# EAGLE design ASD2111 (EAGLE 6.3)
DATABASE: ./../../../../../Components/TinyCircuits_Part_Database.txt
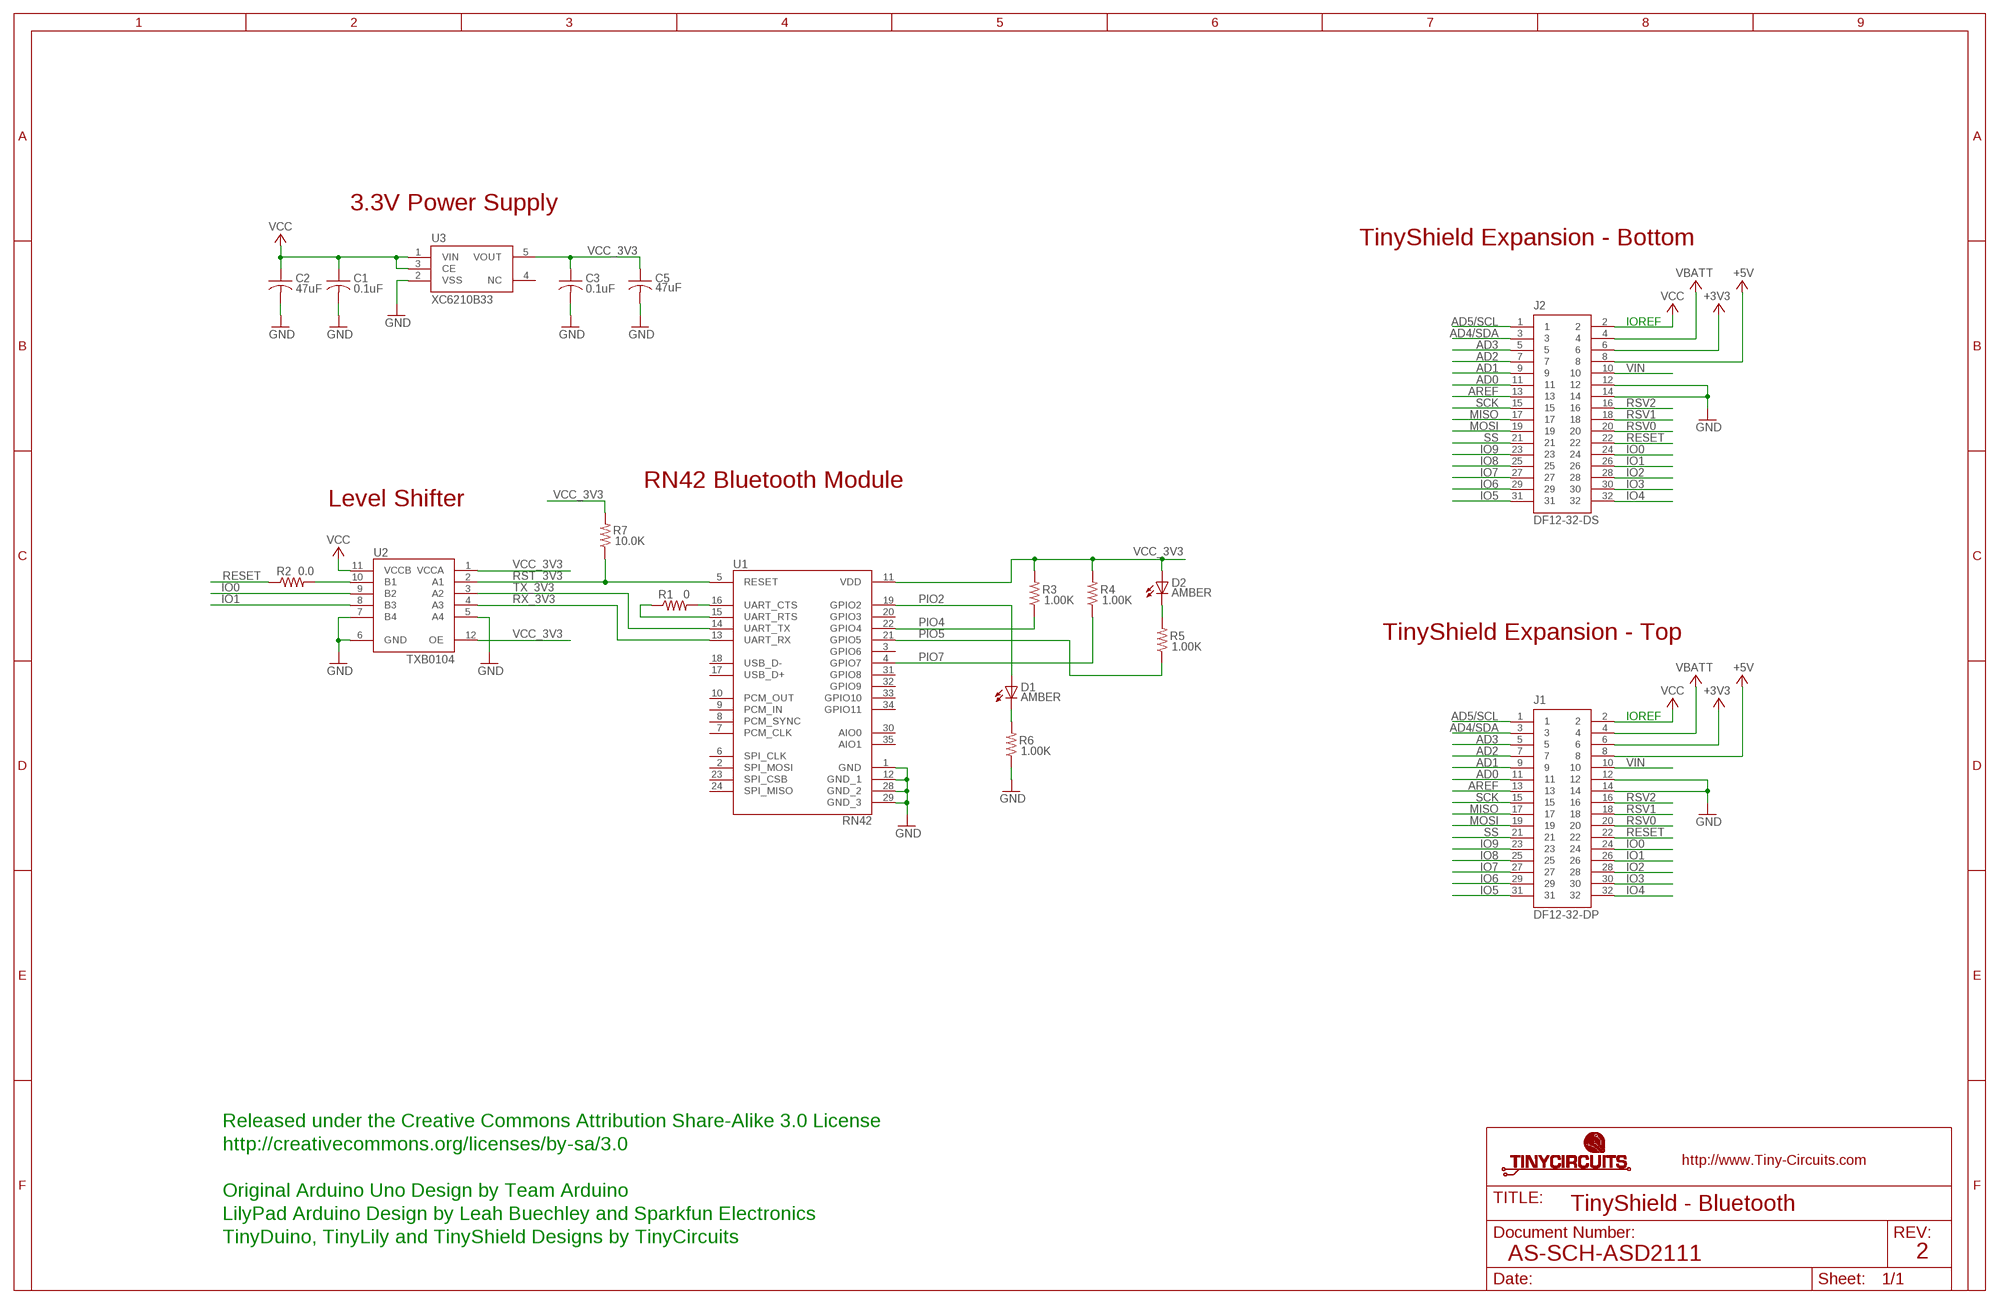
[diagram p0: schematic, sheet 1]

## Parts
C1  0.1uF  AS-ITM-00008  [C0402]
C2  47uF  AS-ITM-00049  [C1206]
C3  0.1uF  AS-ITM-00008  [C0402]
C5  47uF  AS-ITM-00049  [C1206]
D1  AMBER  AS-ITM-00026  [LNJ_LED]
D2  AMBER  AS-ITM-00026  [LNJ_LED]
J1  DF12-32-DP  AS-ITM-00015  [DF12-32-DP]
J2  DF12-32-DS  AS-ITM-00012  [DF12-32-DS]
R1  0  AS-ITM-000760402_SHORT  [0402_SHORT]
R2  0.0  AS-ITM-00076  [0402]
R3  1.00K  AS-ITM-00003  [0402]
R4  1.00K  AS-ITM-00003  [0402]
R5  1.00K  AS-ITM-00003  [0402]
R6  1.00K  AS-ITM-00003  [0402]
R7  10.0K  AS-ITM-00032  [0402]
U1  RN42  AS-ITM-00071  [RN42_BLUETOOTH_MODULE]
U2  TXB0104  AS-ITM-00048  [UQFN-12]
U3  XC6210B33  AS-ITM-00046  [SOT-25]

## Nets
+3V3: J1.6 J2.6
+5V: J1.8 J2.8
AD0: J1.11 J2.11
AD1: J1.9 J2.9
AD2: J1.7 J2.7
AD3: J1.5 J2.5
AD4/SDA: J1.3 J2.3
AD5/SCL: J1.1 J2.1
AREF: J1.13 J2.13
GND: C1.2 C2.2 C3.2 C5.2 J1.12 J1.14 J2.12 J2.14 R6.1 U1.1(GND) U1.12(GND_1) U1.28(GND_2) U1.29(GND_3) U2.5(A4) U2.6(GND) U2.7(B4) U3.2(VSS)
IO0: J1.24 J2.24 U2.9(B2)
IO1: J1.26 J2.26 U2.8(B3)
IO2: J1.28 J2.28
IO3: J1.30 J2.30
IO4: J1.32 J2.32
IO5: J1.31 J2.31
IO6: J1.29 J2.29
IO7: J1.27 J2.27
IO8: J1.25 J2.25
IO9: J1.23 J2.23
MISO: J1.17 J2.17
MOSI: J1.19 J2.19
N$4: R1.2 U1.16(UART_CTS)
N$5: R1.1 U1.15(UART_RTS)
N$6: R2.2 U2.10(B1)
N$8: D1.C R6.2
N$9: D2.C R5.2
PIO2: D1.A U1.19(GPIO2)
PIO4: R3.1 U1.22(GPIO4)
PIO5: R5.1 U1.21(GPIO5)
PIO7: R4.1 U1.4(GPIO7)
RESET: J1.22 J2.22 R2.1
RST_3V3: R7.1 U1.5(RESET) U2.2(A1)
RSV0: J1.20 J2.20
RSV1: J1.18 J2.18
RSV2: J1.16 J2.16
RX_3V3: U1.13(UART_RX) U2.4(A3)
SCK: J1.15 J2.15
SS: J1.21 J2.21
TX_3V3: U1.14(UART_TX) U2.3(A2)
VBATT: J1.4 J2.4
VCC: C1.1 C2.1 J1.2 J2.2 U2.11(VCCB) U3.1(VIN) U3.3(CE)
VCC_3V3: C3.1 C5.1 D2.A R3.2 R4.2 R7.2 U1.11(VDD) U2.1(VCCA) U2.12(OE) U3.5(VOUT)
VIN: J1.10 J2.10
Unconnected: U1.2(SPI_MOSI) U1.3(GPIO6) U1.6(SPI_CLK) U1.7(PCM_CLK) U1.8(PCM_SYNC) U1.9(PCM_IN) U1.10(PCM_OUT) U1.17(USB_D+) U1.18(USB_D-) U1.20(GPIO3) U1.23(SPI_CSB) U1.24(SPI_MISO) U1.30(AIO0) U1.31(GPIO8) U1.32(GPIO9) U1.33(GPIO10) U1.34(GPIO11) U1.35(AIO1) U3.4(NC)

## Notes on the sheet
- 3.3V Power Supply
- TinyShield Expansion - Bottom
- IOREF
- RN42 Bluetooth Module
- Level Shifter
- TinyShield Expansion - Top
- IOREF
- Released under the Creative Commons Attribution Share-Alike 3.0 License
- http://creativecommons.org/licenses/by-sa/3.0
- Original Arduino Uno Design by Team Arduino
- TinyShield - Bluetooth
- LilyPad Arduino Design by Leah Buechley and Sparkfun Electronics
- TinyDuino, TinyLily and TinyShield Designs by TinyCircuits
- AS-SCH-ASD2111 | 2

## Library data of the parts
C1 C3 = tinycircuits:AS-ITM-00008: CAP CER 0.1UF 16V 10% X5R 0402; PARTNO: AS-ITM-00008
C2 C5 = tinycircuits:AS-ITM-00049: CAP CER 47UF 6.3V 20% X6S 1206; PARTNUM: AS-ITM-00049
D1 D2 = tinycircuits:AS-ITM-00026: LED AMBER SIDE VIEW SMD; PARTNO: AS-ITM-00026
J1 = tinycircuits:AS-ITM-00015: CONN HEADER 32POS 3MM SMD 0.5MM; PARTNO: AS-ITM-00015
J2 = tinycircuits:AS-ITM-00012: CONN RECEPT 32POS 3MM SMD 0.5MM; PARTNO: AS-ITM-00012
R1 = tinycircuits:AS-ITM-00076: RES 0.0 OHM 1/16W 1% 0402 SMD
R2 = tinycircuits:AS-ITM-00076: RES 0.0 OHM 1/16W 1% 0402 SMD; PARTNO: AS-ITM-00076
R3-R6 = tinycircuits:AS-ITM-00003: RES 1.00K OHM 1/16W 1% 0402; PARTNO: AS-ITM-00003
R7 = tinycircuits:AS-ITM-00032: RES 10.0K OHM 1/16W 1% 0402 SMD; PARTNO: AS-ITM-00032
U1 = tinycircuits:AS-ITM-00071: RN42 BLUETOOTH MODULE; PARTNO: AS-ITM-00071
U2 = tinycircuits:AS-ITM-00048: IC VOLT-LEVEL TRANSLATOR 12UQFN; PARTNO: AS-ITM-00048
U3 = tinycircuits:AS-ITM-00046: IC REG LDO 3.3V .7A SOT-25; PARTNO: AS-ITM-00046

## Board
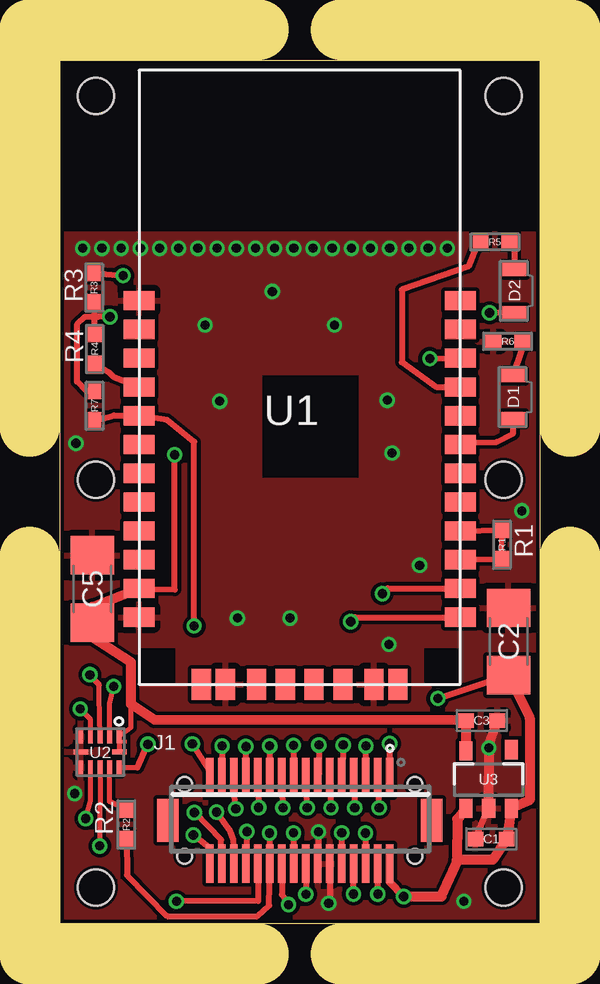
[diagram p1: board, top side]
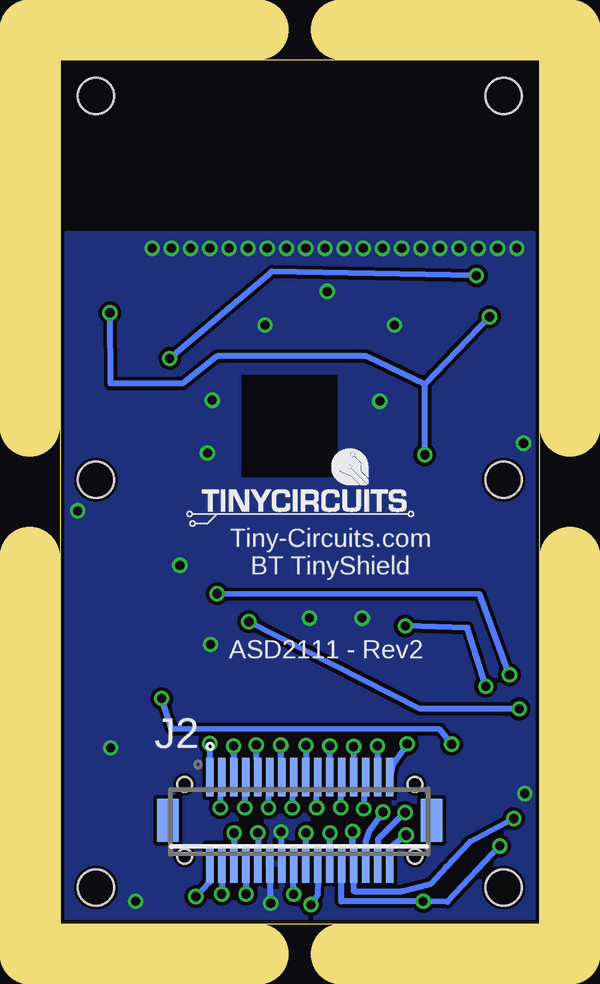
[diagram p2: board, bottom side, seen from below]

Size 20 x 36 mm. Coordinates in mm from the lower left corner, seen from the top.
Outline: 0,36 20,36 20,0 0,0 0,36
Copper layers (1*16): Top 0.035mm / dielectric 1.5mm / Bottom 0.035mm
Design rules "default *": minimum track width 8mil, minimum drill 15mil, track to track 6mil, track to pad 6mil, pad to pad 6mil, via to via 6mil, smd to smd 6mil, copper to edge 6mil, drill to drill 8mil, minimum pad ring 10mil, minimum via ring 5mil, stop-mask expansion 4mil, vias tented up to drill 25mil, thermal gap 10mil
Holes 1.5 mm at 1.5,18.5 18.5,18.5 18.5,1.5 1.5,1.5 1.5,34.5 18.5,34.5
tRestrict: area 8.4,18.6 to 12.4,22.8
bRestrict: area 8.4,18.6 to 12.4,22.9
Milling: 8 lines

### Footprints (pad centres in the part's own frame; a part is rotated, then mirrored left to right if it is on the bottom)
C0402 = smd 0.65 x 0.6: 1 -0.65,0; 2 0.65,0
C1206 = smd 1.6 x 1.8: 1 -1.4,0; 2 1.4,0
LNJ_LED = smd 1 x 0.55: A 0,0.9; C 0,-0.9
DF12-32-DP = smd 0.3 x 1.6: 1 -3.75,-1.8; 2 -3.75,1.8; 3 -3.25,-1.8; 4 -3.25,1.8; 5 -2.75,-1.8; 6 -2.75,1.8; 7 -2.25,-1.8; 8 -2.25,1.8; 9 -1.75,-1.8; 10 -1.75,1.8; 11 -1.25,-1.8; 12 -1.25,1.8; 13 -0.75,-1.8; 14 -0.75,1.8; 15 -0.25,-1.8; 16 -0.25,1.8; 17 0.25,-1.8; 18 0.25,1.8; 19 0.75,-1.8; 20 0.75,1.8; 21 1.25,-1.8; 22 1.25,1.8; 23 1.75,-1.8; 24 1.75,1.8; 25 2.25,-1.8; 26 2.25,1.8; 27 2.75,-1.8; 28 2.75,1.8; 29 3.25,-1.8; 30 3.25,1.8; 31 3.75,-1.8; 32 3.75,1.8 | smd 0.9 x 1.8: F1 -5.5,0; F2 5.5,0 | hole 0.6: -4.8,1.5; 4.8,1.5
DF12-32-DS = smd 0.3 x 1.6: 1 -3.75,1.8; 2 -3.75,-1.8; 3 -3.25,1.8; 4 -3.25,-1.8; 5 -2.75,1.8; 6 -2.75,-1.8; 7 -2.25,1.8; 8 -2.25,-1.8; 9 -1.75,1.8; 10 -1.75,-1.8; 11 -1.25,1.8; 12 -1.25,-1.8; 13 -0.75,1.8; 14 -0.75,-1.8; 15 -0.25,1.8; 16 -0.25,-1.8; 17 0.25,1.8; 18 0.25,-1.8; 19 0.75,1.8; 20 0.75,-1.8; 21 1.25,1.8; 22 1.25,-1.8; 23 1.75,1.8; 24 1.75,-1.8; 25 2.25,1.8; 26 2.25,-1.8; 27 2.75,1.8; 28 2.75,-1.8; 29 3.25,1.8; 30 3.25,-1.8; 31 3.75,1.8; 32 3.75,-1.8 | smd 0.9 x 1.8: F1 -5.5,0; F2 5.5,0 | hole 0.6: -4.8,1.5; 4.8,1.5
0402_SHORT = smd 0.65 x 0.55: 1 -0.6,0; 2 0.6,0
0402 = smd 0.65 x 0.55: 1 -0.6,0; 2 0.6,0
RN42_BLUETOOTH_MODULE = smd 1.3 x 0.8: 1 -6.35,4.57; 2 -6.35,3.37; 3 -6.35,2.17; 4 -6.35,0.97; 5 -6.35,-0.23; 6 -6.35,-1.43; 7 -6.35,-2.63; 8 -6.35,-3.83; 9 -6.35,-5.03; 10 -6.35,-6.23; 11 -6.35,-7.43; 12 -6.35,-8.63; 13 7.05,-8.63; 14 7.05,-7.43; 15 7.05,-6.23; 16 7.05,-5.03; 17 7.05,-3.83; 18 7.05,-2.63; 19 7.05,-1.43; 20 7.05,-0.23; 21 7.05,0.97; 22 7.05,2.17; 23 7.05,3.37; 24 7.05,4.57 | smd 0.8 x 1.3: 28 3.45,-11.43; 29 -2.75,-11.43; 30 4.45,-11.43; 31 2.15,-11.43; 32 0.95,-11.43; 33 -0.25,-11.43; 34 -1.45,-11.43; 35 -3.75,-11.43
UQFN-12 = smd 0.2 x 0.6: 1 -0.8,-0.65; 2 -0.4,-0.65; 3 0,-0.65; 4 0.4,-0.65; 5 0.8,-0.65; 7 0.8,0.65; 8 0.4,0.65; 9 0,0.65; 10 -0.4,0.65; 11 -0.8,0.65 | smd 0.6 x 0.2: 6 0.8,0; 12 -0.8,0
SOT-25 = smd 0.55 x 0.8: 1 -0.95,-1.2; 2 0,-1.2; 3 0.95,-1.2; 4 0.95,1.25; 5 -0.95,1.2

### Placement (x,y rotation side)
C1  17.98,3.53 180 top
C2  18.71,11.76 90 top
C3  17.59,8.46 0 top
C5  1.35,13.95 90 top
D1  18.9,21.94 180 top
D2  18.95,26.37 180 top
J1  10,4.3 180 top
J2  10,4.3 0 bottom
R1  18.44,15.8 90 top
R2  2.77,4.13 90 top
R3  1.43,26.51 270 top
R4  1.46,23.96 90 top
R5  18.14,28.41 0 top
R6  18.67,24.27 0 top
R7  1.45,21.59 90 top
U1  9.65,21.4 0 top
U2  1.67,7.16 180 top
U3  17.87,6 0 top
U$1  [DOCFIELD-TINYCIRCUITS-PCB]  33.91,-10 0 top  (outside the outline)

### Tracks (layer width: path | path; a pad name or v marks a point on that pad's centre or on a via)
+3V3  (via drill 0.38)
  Top 0.254: J2.6 v12.75,3.77 v12.74,3.77
  Bottom 0.254: v12.74,3.77 12.74,2.51 J2.6
+5V  (via drill 0.38)
  Top 0.254: v12.24,1.23 J2.8
  Bottom 0.254: J2.8 12.25,1.21 v12.24,1.23
AD0  (via drill 0.38)
  Top 0.254: v11.3,4.83 11.31,5.05 J2.11
  Bottom 0.254: J2.11 11.28,5.79 v11.3,4.83
AD1  (via drill 0.38)
  Top 0.254: J2.9 11.79,6.27 v11.81,7.44
  Bottom 0.254: v11.81,7.44 11.78,6.22 J2.9
AD2  (via drill 0.38)
  Top 0.254: v12.29,4.83 12.31,5.05 J2.7
  Bottom 0.254: J2.7 12.27,5.86 v12.29,4.83
AD3  (via drill 0.38)
  Top 0.254: J2.5 v12.76,7.4
  Bottom 0.254: v12.76,7.4 J2.5
AD4/SDA  (via drill 0.38)
  Top 0.254: v13.31,4.83 13.31,5 J2.3
  Bottom 0.254: J2.3 13.28,5.86 v13.31,4.83
AD5/SCL  (via drill 0.38)
  Top 0.254: v13.75,7.5 J2.1
  Bottom 0.254: J2.1 v13.75,7.5
AREF  (via drill 0.38)
  Top 0.254: J2.13 10.8,6.27 v10.8,7.44
  Bottom 0.254: v10.8,7.44 10.77,6.59 J2.13
GND  (via drill 0.38)
  Top 0.254: v11.21,0.85 11.21,1 11.25,1.04 J2.12 11.25,0.86 v11.21,0.85 | v11.21,0.85 11.21,0.79 11.23,0.77 | C1.2 U3.2 | v10.78,3.82 J2.14
  Top 0.406: C3.2 17.89,7.5 U3.2
  Bottom 0.254: 11.25,1.79 11.25,0.86 v11.21,0.85 | J2.14 v10.78,3.82
  other vias: 17.89,7.32 6.05,24.95 6.66,21.78 13.85,19.62 19.26,17.2 16.85,0.92 7.4,12.73 0.67,20.02 13.72,11.64 0.62,5.42 2.55,28.15 3.35,28.15 4.15,28.15 4.95,28.15 5.75,28.15 6.55,28.15 7.35,28.15 8.15,28.15 8.95,28.15 9.75,28.15 10.55,28.15 11.35,28.15 12.15,28.15 12.95,28.15 13.75,28.15 14.55,28.15 15.35,28.15 16.15,28.15 1.75,28.15 0.95,28.15 8.85,26.35 11.45,24.95 13.65,21.82 9.6,12.73 15,14.93
  pour Top: 0.25,28.75 19.75,28.75 19.75,0.25 0.25,0.25
  pour Bottom: 0.25,28.75 19.75,28.75 19.75,0.25 0.25,0.25
IO0  (via drill 0.38)
  Top 0.203: U2.9 v1.66,3.23
  Top 0.254: J2.24 8.26,2.5 8.26,0.95 v4.86,0.92
  Bottom 0.254: J2.24 8.26,0.92 v4.86,0.92 3.84,0.9 v1.66,3.23
IO1  (via drill 0.38)
  Top 0.203: v1.07,4.38 1.28,5.11 U2.8
  Top 0.254: v7.8,3.84 J2.26
  Bottom 0.254: J2.26 v7.8,3.84 7.83,3.59 7.75,1.35 5.75,1.35 4.53,1.66 3.89,2.37 2.9,3.41 v1.07,4.38
IO2  (via drill 0.38)
  Top 0.254: v6.53,4.64 7.07,3.89 7.22,3.49 7.29,2.61 7.26,2.51 J2.28
  Bottom 0.254: J2.28 7.24,3.43 7.07,3.88 v6.53,4.64
IO3  (via drill 0.38)
  Top 0.254: J2.30 6.73,3.49 v5.61,4.63
  Bottom 0.254: v5.61,4.63 6.75,3.51 6.77,2.53 J2.30
IO4  (via drill 0.38)
  Top 0.254: J2.32 6.25,3.14 v5.56,3.69
  Bottom 0.254: v5.56,3.69 5.61,3.65 6.21,3.18 6.21,3.14 6.26,3.1 J2.32
IO5  (via drill 0.38)
  Top 0.254: v5.52,7.49 6.23,6.38 J2.31
  Bottom 0.254: J2.31 6.11,6.64 v5.52,7.49
IO6  (via drill 0.38)
  Top 0.254: J2.29 6.76,6.11 v6.76,7.4
  Bottom 0.254: J2.29 6.75,7.39 v6.76,7.4
IO7  (via drill 0.38)
  Top 0.254: v7.33,4.78 7.31,4.9 J2.27
  Bottom 0.254: J2.27 7.29,5.76 v7.33,4.78
IO8  (via drill 0.38)
  Top 0.254: J2.25 v7.75,7.37
  Bottom 0.254: v7.75,7.37 J2.25
IO9  (via drill 0.38)
  Top 0.254: v8.29,4.83 8.31,4.98 J2.23
  Bottom 0.254: J2.23 8.28,5.59 v8.29,4.83
MISO  (via drill 0.38)
  Top 0.254: J2.17 v9.75,7.41 v9.74,7.42
  Bottom 0.254: v9.74,7.42 9.74,6.11 J2.17
MOSI  (via drill 0.38)
  Top 0.254: v9.3,4.83 9.31,4.95 J2.19
  Bottom 0.254: J2.19 9.27,5.76 v9.3,4.83
N$4
  Top 0.254: U1.16 R1.2
N$5
  Top 0.254: U1.15 R1.1
N$6
  Top 0.203: R2.2 2.14,5.06 2.07,5.09 U2.10
N$8
  Top 0.254: D1.C 19.27,23.96 R6.2
N$9
  Top 0.254: R5.2 18.95,28.2 D2.C
PIO2
  Top 0.254: U1.19 16.78,20 16.92,20 16.82,20.05 18.22,20.07 18.9,20.43 D1.A
PIO4  (via drill 0.38)
  Top 0.254: R3.1 v2.63,27.01 | v15.43,23.55 U1.22
  Bottom 0.254: v2.63,27.01 11.16,27.19 v15.43,23.55
PIO5
  Top 0.254: R5.1 17.43,28.38 17.02,27.39 14.26,26.43 14.26,23.4 15.69,22.37 U1.21
PIO7
  Top 0.254: R4.1 2.04,22.98 2.22,22.81 U1.4
RESET  (via drill 0.38)
  Top 0.254: v8.74,3.77 J2.22 8.77,2.48 8.72,0.74 8.24,0.31 4.48,0.31 2.8,2.02 R2.1
  Bottom 0.254: J2.22 8.75,3.69 v8.74,3.77
RST_3V3  (via drill 0.38)
  Top 0.203: U2.2 2.06,9.15 2.24,9.86 v2.24,9.89
  Top 0.254: v5.6,12.4 5.6,20.07 4.48,20.99 U1.5 3.29,21.18 2.25,21.18 1.8,21.06 R7.1
  Bottom 0.254: v2.24,9.89 3.01,12.33 v5.6,12.4
RSV0  (via drill 0.38)
  Top 0.254: J2.20 9.25,1.2 v9.54,0.79
  Bottom 0.254: J2.20 9.25,1.84 9.25,1.2 v9.54,0.79
RSV1  (via drill 0.38)
  Top 0.254: v9.74,3.77 9.74,2.51 J2.18
  Bottom 0.254: J2.18 9.75,3.72 v9.74,3.77
RSV2  (via drill 0.38)
  Top 0.254: J2.16 10.25,1.16 v10.25,1.22
  Bottom 0.254: v10.25,1.22 J2.16
RX_3V3  (via drill 0.38)
  Top 0.203: U2.4 1.28,8.51 v0.85,8.95
  Top 0.254: v12.12,12.58 12.31,12.77 U1.13
  Bottom 0.254: v0.85,8.95 4.99,8.95 v12.12,12.58
SCK  (via drill 0.38)
  Top 0.254: v10.31,4.83 10.31,4.98 J2.15
  Bottom 0.254: J2.15 10.29,5.66 v10.31,4.83
SS  (via drill 0.38)
  Top 0.254: v8.75,7.4 J2.21
  Bottom 0.254: J2.21 v8.75,7.39 v8.75,7.4
TX_3V3  (via drill 0.38)
  Top 0.203: U2.3 1.63,9.5 1.63,9.94
  Top 0.254: 1.63,9.94 1.25,10.34 v1.25,10.37 | v13.44,13.75 13.66,13.97 U1.14
  Bottom 0.254: v1.25,10.37 2.5,13.72 v13.44,13.75
VBATT  (via drill 0.38)
  Top 0.254: v13.25,1.23 J2.4
  Bottom 0.254: J2.4 13.25,1.24 v13.25,1.23
VCC  (via drill 0.38)
  Top 0.203: U2.11 3.23,6.51
  Top 0.254: 16.54,2.65 16.61,2.68 | J2.2 13.75,1.73 | 3.23,6.51 v3.66,7.48 | v15.76,9.38 C2.1
  Top 0.305: 13.75,1.73 v14.33,1.12
  Top 0.406: C2.1 19.59,8.57 19.59,5.14 U3.3 C1.1 18.07,2.68 16.61,2.68 15.91,1.12 v14.33,1.12 | U3.1 16.57,4.35 16.54,2.65
  Bottom 0.254: v14.33,1.12 13.77,1.71 J2.2 | v3.66,7.48 4.15,8.09 15.35,8.11 v15.76,9.38
VCC_3V3  (via drill 0.38)
  Top 0.203: 2.95,9.15 2.95,8.16 U2.1 U2.12
  Top 0.254: C5.1 1.35,13.21 3.39,13.95 4.78,13.93 v4.78,19.54 | R4.2 1.45,25.3 | 1.45,25.3 R3.2 | v2.08,25.29 1.45,25.3 | v17.91,25.46 18.04,25.48 D2.A | R7.2 1.1,22.2 0.71,22.59 0.72,24.99 1.05,25.3 1.6,25.3 1.45,25.3
  Top 0.406: 1.35,13.21 U1.11 | C5.1 1.3,11.97 2.95,10.9 2.95,9.15 3.95,8.49 C3.1 U3.5
  Bottom 0.254: v4.78,19.54 4.78,22.49 | 4.78,22.49 v2.08,25.29 | 4.78,22.49 7.22,23.66 13.44,23.66 14.89,22.51 17.89,22.51 v17.91,25.46
VIN  (via drill 0.38)
  Top 0.254: J2.10 v11.76,3.78 v11.75,3.78
  Bottom 0.254: v11.75,3.78 J2.10

### Text on the board
tPlace: R3 | R4 | R1 | R2
bPlace: Tiny-Circuits.com | BT TinyShield | ASD2111 - Rev2
Document: FABRICATION DRAWING | NOTES: | 1. PRINTED CIRCUIT BOARD MADE FROM NEMA GRADE FR-4 EPOXY LAMINATE | WITH 1 OUNCE COPPER PLATING AND .024 THICKNESS. | 2. ALL DIMENSIONS ARE GIVEN IN INCHES. | 3. CIRCUIT PATHS ARE FOR REFERENCE ONLY. | 4. HOLE SIZES SHOWN ARE FINISHED DIAMETERS AFTER PLATING. | 5. BOARD PLATED USING REFLOW OR SIMILAR METHOD. | 6. BOARD TO HAVE BLUE SOLDER MASK ON PLATED SURFACES USING WET FILM | 7. SILKSCREEN BOARD USING WHITE INK. | SR100 OR SR1010 EPOXY. EQUIVALENT WET OR DRY FILM MAY BE USED. | 8. THE FOLLOWING INFORMATION APPLIES TO THIS BOARD: | * 2 COPPER LAYERS | * .024 BOARD THICKNESS | * REQUIRES TOP SIDE SILKSCREEN | Released under the Creative Commons Attribution Share-Alike 3.0 License | http://creativecommons.org/licenses/by-sa/3.0 | Original Arduino Uno Design by Team Arduino | LilyPad Arduino Design by Leah Buechley and Sparkfun Electronics | TinyDuino, TinyLily and TinyShield Designs by TinyCircuits | TinyShield - Bluetooth | AS-PCB-ASD2111 | 2